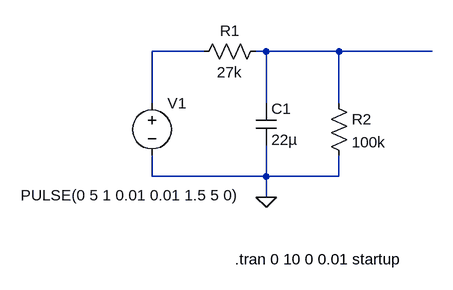
[diagram p0: schematic simulation.asc]
simulation.asc, the LTspice schematic file:
Version 4
SHEET 1 880 680
WIRE 16 48 -64 48
WIRE 112 48 96 48
WIRE 224 48 112 48
WIRE 368 48 224 48
WIRE -64 128 -64 48
WIRE 112 128 112 48
WIRE 224 128 224 48
WIRE -64 240 -64 208
WIRE 112 240 112 192
WIRE 112 240 -64 240
WIRE 224 240 224 208
WIRE 224 240 112 240
WIRE 112 272 112 240
FLAG 112 272 0
SYMBOL voltage -64 112 R0
WINDOW 123 0 0 Left 0
WINDOW 39 0 0 Left 0
WINDOW 3 -202 157 Left 2
SYMATTR Value PULSE(0 5 1 0.01 0.01 1.5 5 0)
SYMATTR InstName V1
SYMBOL cap 96 128 R0
SYMATTR InstName C1
SYMATTR Value 22µ
SYMBOL res 112 32 R90
WINDOW 0 0 56 VBottom 2
WINDOW 3 32 56 VTop 2
SYMATTR InstName R1
SYMATTR Value 27k
SYMBOL res 208 112 R0
SYMATTR InstName R2
SYMATTR Value 100k
TEXT 64 368 Left 2 !.tran 0 10 0 0.01 startup

The netlist it stands for:
* simulation.asc
V1 N001 0 PULSE(0 5 1 0.01 0.01 1.5 5 0)
C1 N002 0 22µ
R1 N002 N001 27k
R2 N002 0 100k
.tran 0 10 0 0.01 startup
.backanno
.end